# EAGLE schematic Esquema_PowerBox1 (EAGLE 8.0.1)
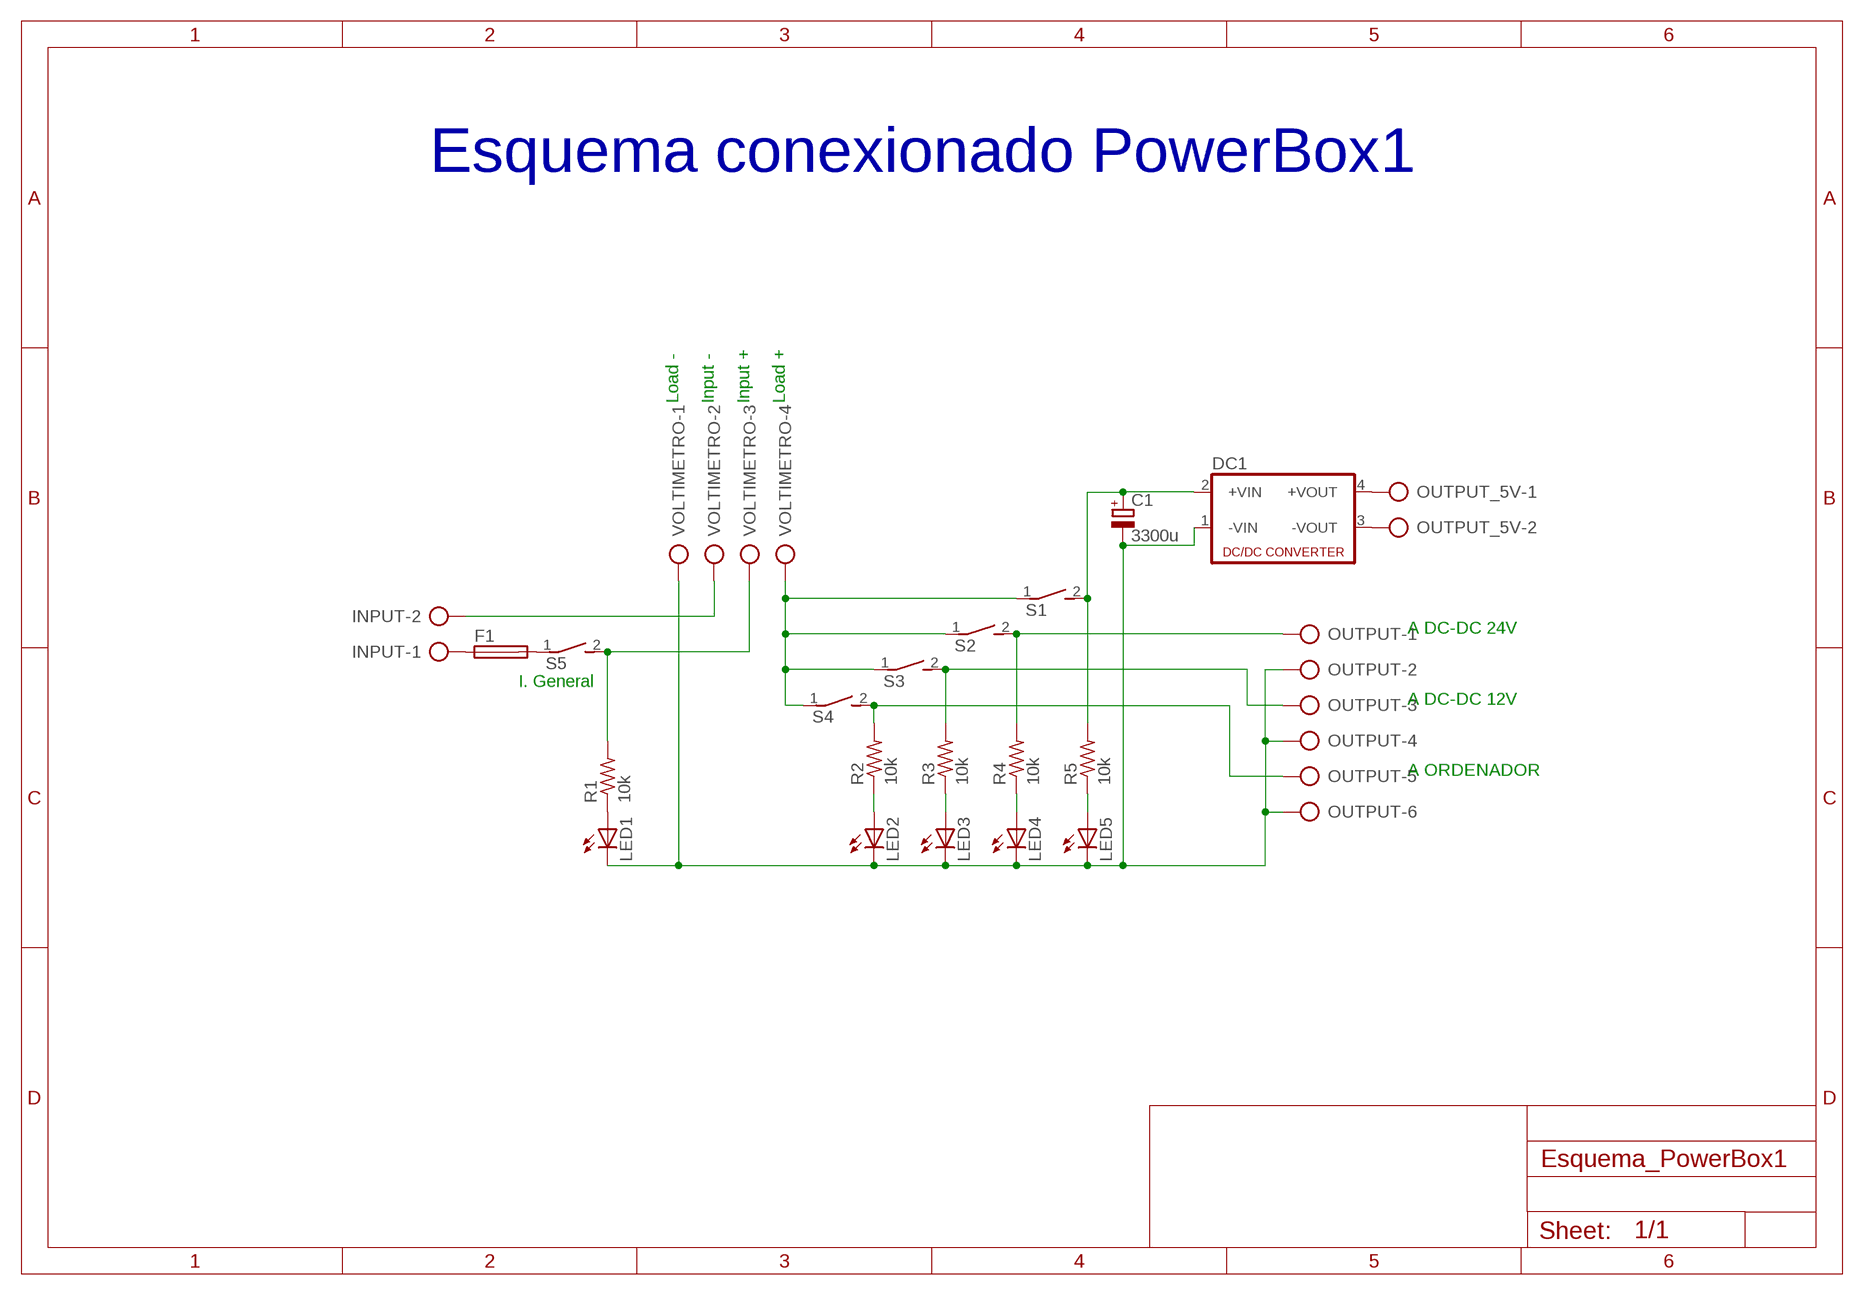
[diagram p0: schematic, sheet 1]

## Parts
C1  3300u  CPOL-EU150CLZ-1014  [150CLZ-1014]
DC1  NME  [NME]
F1  PICOFUSE  [PICOFUSE]
INPUT  AK500/2  [AK500/2]
LED1  LEDB155  [Q62902-B155]
LED2  LEDB155  [Q62902-B155]
LED3  LEDB155  [Q62902-B155]
LED4  LEDB155  [Q62902-B155]
LED5  LEDB155  [Q62902-B155]
OUTPUT  AK500/6  [AK500/6]
OUTPUT_5V  AK500/2  [AK500/2]
R1  10k  R-US_0207/7  [0207/7]
R2  10k  R-US_0207/7  [0207/7]
R3  10k  R-US_0207/7  [0207/7]
R4  10k  R-US_0207/7  [0207/7]
R5  10k  R-US_0207/7  [0207/7]
S1  DS01E  [DS-01]
S2  DS01E  [DS-01]
S3  DS01E  [DS-01]
S4  DS01E  [DS-01]
S5  DS01E  [DS-01]
VOLTIMETRO  AK500/4  [AK500/4]

## Nets
N$1: F1.1 INPUT.1
N$2: INPUT.2 VOLTIMETRO.2
N$3: LED5.A R5.1
N$4: LED1.A R1.1
N$5: LED2.A R2.1
N$6: LED3.A R3.1
N$7: LED4.A R4.1
N$8: F1.2 S5.1
N$11: OUTPUT.3 R3.2 S3.2
N$12: OUTPUT.1 R4.2 S2.2
N$13: C1.+ DC1.2(+VIN) R5.2 S1.2
N$14: S1.1 S2.1 S3.1 S4.1 VOLTIMETRO.4
N$15: C1.- DC1.1(-VIN) LED1.K(C) LED2.K(C) LED3.K(C) LED4.K(C) LED5.K(C) OUTPUT.2 OUTPUT.4 OUTPUT.6 VOLTIMETRO.1
N$17: OUTPUT.5 R2.2 S4.2
N$18: DC1.4(+VOUT) OUTPUT_5V.1
N$19: DC1.3(-VOUT) OUTPUT_5V.2
N$20: R1.2 S5.2 VOLTIMETRO.3

## Notes on the sheet
- Esquema conexionado PowerBox1
- Load - | Input - | Input + | Load +
- A DC-DC 24V
- I. General
- A DC-DC 12V
- A ORDENADOR

## Library data of the parts
C1 = rcl:CPOL-EU: POLARIZED CAPACITOR, European symbol
DC1 = dc-dc-converter:NME: DC-DC CONVERTER; MF: C & D TECHNOLOGIES, INC; MPN: NME1205D; OC_FARNELL: 1021466; OC_NEWARK: 98B8198
F1 = fuse:PICOFUSE: PICOFUSE 19275, Wickmann; OC_FARNELL: unknown; OC_NEWARK: unknown
INPUT OUTPUT_5V = con-ptr500:AK500/2: CONNECTOR; OC_FARNELL: unknown; OC_NEWARK: unknown
LED1-LED5 = led:LED: LED OSRAM: - CHIPLED LG R971, LG N971, LY N971, LG Q971, LY Q971, LO R971, LY R971 LH N974, LH R974 LS Q976, LO Q976, LY Q976 LO Q996 - Hyper CHIPLED LW Q18S LB Q993, LB Q99A, LB R99A - SideLED LS A670, LO A670, LY A670, LG A670, LP A670 LB A673, LV A673, LT A673, LW A673 LH A674 LY A675 LS A676, LA A676, LO A676, LY A676, LW A676 LS A679, LY A679, LG A679 - Hyper Micro SIDELED® LS Y876, LA Y876, LO Y876, LY Y876 LT Y87S - SmartLED LW L88C, LW L88S LB L89C, LB L89S, LG L890 LS L89K, LO L89K, LY L89K LS L896, LA L896, LO L896, LY L896 - TOPLED LS T670, LO T670, LY T670, LG T670, LP T670 LSG T670, LSP T670, LSY T670, LOP T670, LYG T670 LG T671, LOG T671, LSG T671 LB T673, LV T673, LT T673, LW T673 LH T674 LS T676, LA T676, LO T676, LY T676, LB T676, LH T676, LSB T676, LW T676 LB T67C, LV T67C, LT T67C, LS T67K, LO T67K, LY T67K, LW E67C LS E67B, LA E67B, LO E67B, LY E67B, LB E67C, LV E67C, LT E67C LW T67C LS T679, LY T679, LG T679 LS T770, LO T770, LY T770, LG T770, LP T770 LB T773, LV T773, LT T773, LW T773 LH T774 LS E675, LA E675, LY E675, LS T675 LS T776, LA T776, LO T776, LY T776, LB T776 LHGB T686 LT T68C, LB T68C - Hyper Mini TOPLED® LB M676 - Mini TOPLED Santana® LG M470 LS M47K, LO M47K, LY M47K Source: http://www.osram.convergy.de LUXEON: - LUMILED® LXK2-PW12-R00, LXK2-PW12-S00, LXK2-PW14-U00, LXK2-PW14-V00 LXK2-PM12-R00, LXK2-PM12-S00, LXK2-PM14-U00 LXK2-PE12-Q00, LXK2-PE12-R00, LXK2-PE12-S00, LXK2-PE14-T00, LXK2-PE14-U00 LXK2-PB12-K00, LXK2-PB12-L00, LXK2-PB12-M00, LXK2-PB14-N00, LXK2-PB14-P00, LXK2-PB14-Q00 LXK2-PR12-L00, LXK2-PR12-M00, LXK2-PR14-Q00, LXK2-PR14-R00 LXK2-PD12-Q00, LXK2-PD12-R00, LXK2-PD12-S00 LXK2-PH12-R00, LXK2-PH12-S00 LXK2-PL12-P00, LXK2-PL12-Q00, LXK2-PL12-R00 Source: www.luxeon.com KINGBRIGHT: KA-3528ASYC Source: www.kingbright.com
OUTPUT = con-ptr500:AK500/6: CONNECTOR; OC_FARNELL: unknown; OC_NEWARK: unknown
R1-R5 = rcl:R-US_: RESISTOR, American symbol
S1-S5 = switch-dil:DS01E: DIL/CODE SWITCH; OC_FARNELL: unknown; OC_NEWARK: unknown
VOLTIMETRO = con-ptr500:AK500/4: CONNECTOR; OC_FARNELL: unknown; OC_NEWARK: unknown